# EAGLE design Debug Board (EAGLE 9.6.2)
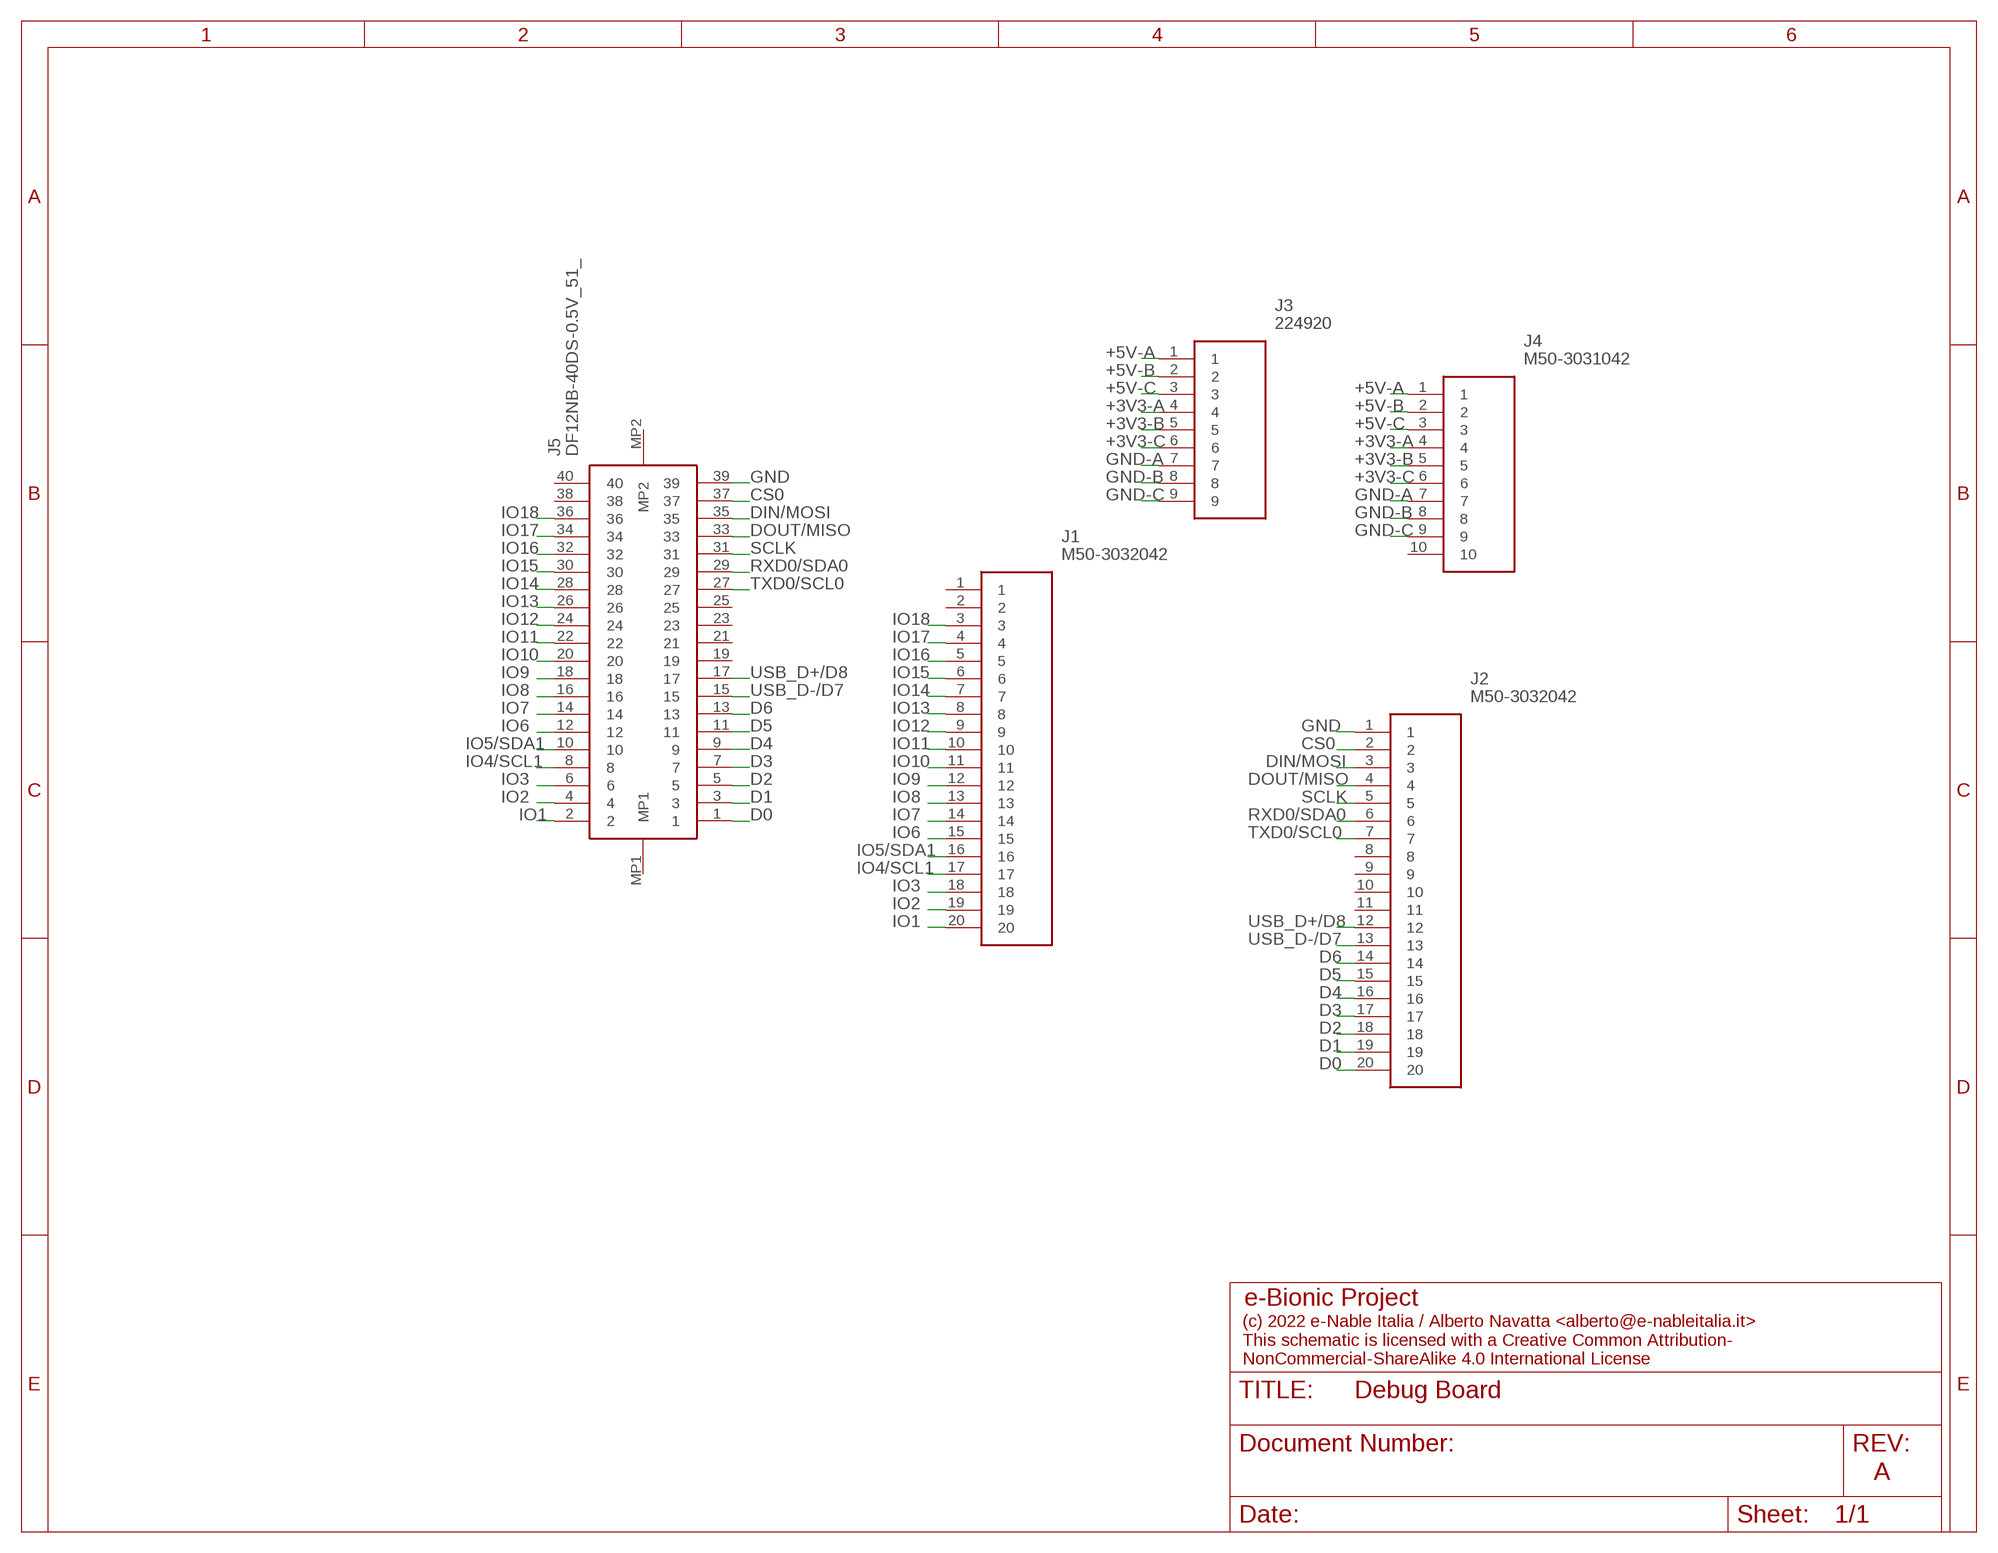
[diagram p0: schematic, sheet 1]

## Parts
J1  M50-3032042  [M503032042]
J2  M50-3032042  [M503032042]
J3  224920  [224920]
J4  M50-3031042  [M503031042]
J5  DF12NB-40DS-0.5V_51_  [DF12NB40DS05V51]

## Nets
+3V3-A [Power]: J3.4 J4.4
+3V3-B [Power]: J3.5 J4.5
+3V3-C [Power]: J3.6 J4.6
+5V-A [Power]: J3.1 J4.1
+5V-B [Power]: J3.2 J4.2
+5V-C [Power]: J3.3 J4.3
CS0: J2.2 J5.37
D0: J2.20 J5.1
D1: J2.19 J5.3
D2: J2.18 J5.5
D3: J2.17 J5.7
D4: J2.16 J5.9
D5: J2.15 J5.11
D6: J2.14 J5.13
DIN/MOSI: J2.3 J5.35
DOUT/MISO: J2.4 J5.33
GND [GND]: J2.1 J5.39
GND-A [GND]: J3.7 J4.7
GND-B [GND]: J3.8 J4.8
GND-C [GND]: J3.9 J4.9
IO1: J1.20 J5.2
IO2: J1.19 J5.4
IO3: J1.18 J5.6
IO4/SCL1: J1.17 J5.8
IO5/SDA1: J1.16 J5.10
IO6: J1.15 J5.12
IO7: J1.14 J5.14
IO8: J1.13 J5.16
IO9: J1.12 J5.18
IO10: J1.11 J5.20
IO11: J1.10 J5.22
IO12: J1.9 J5.24
IO13: J1.8 J5.26
IO14: J1.7 J5.28
IO15: J1.6 J5.30
IO16: J1.5 J5.32
IO17: J1.4 J5.34
IO18: J1.3 J5.36
RXD0/SDA0: J2.6 J5.29
SCLK: J2.5 J5.31
TXD0/SCL0: J2.7 J5.27
USB_D+/D8: J2.12 J5.17
USB_D-/D7: J2.13 J5.15
Unconnected: J1.1 J1.2 J2.8 J2.9 J2.10 J2.11 J4.10 J5.19 J5.21 J5.23 J5.25 J5.38 J5.40 J5.MP1 J5.MP2

## Notes on the sheet
- e-Bionic Project
- (c) 2022 e-Nable Italia / Alberto Navatta <alberto@e-nableitalia.it>
  This schematic is licensed with a Creative Common Attribution-
  NonCommercial-ShareAlike 4.0 International License
- A

## Library data of the parts
J1 J2 = SamacSys_Parts:M50-3032042: Headers & Wire Housings 20 WAY SIL VERT PC TAIL SKT Source: Datasheet <https://cdn.harwin.com/pdfs/M50-303.pdf>; DESCRIPTION: Headers & Wire Housings 20 WAY SIL VERT PC TAIL SKT; HEIGHT: 4.55mm; MANUFACTURER_NAME: Harwin; MANUFACTURER_PART_NUMBER: M50-3032042; MOUSER_PART_NUMBER: 855-M50-3032042; MOUSER_PRICE-STOCK: https://www.mouser.co.uk/ProductDetail/Harwin/M50-3032042?qs=%252BdQmOuGyFcG1Q4VMzC2p1Q%3D%3D
J3 = SamacSys_Parts:224920: Board to Board & Mezzanine Connectors 9P 0.8MM VERT FML CLASS 4 3MM SMT Source: Datasheet; DESCRIPTION: Board to Board & Mezzanine Connectors 9P 0.8MM VERT FML CLASS 4 3MM SMT; HEIGHT: 3.96mm; MANUFACTURER_NAME: ERNI; MANUFACTURER_PART_NUMBER: 224920; MOUSER_PART_NUMBER: 305-224920; MOUSER_PRICE-STOCK: https://www.mouser.co.uk/ProductDetail/ERNI/224920?qs=Kh9WxvXxjWmfiTh6L%2FvUxg%3D%3D
J4 = SamacSys_Parts:M50-3031042: Headers & Wire Housings 10 WAY SIL VERT PC TAIL SKT Source: Datasheet <https://cdn.harwin.com/pdfs/M50-303.pdf>; DESCRIPTION: Headers & Wire Housings 10 WAY SIL VERT PC TAIL SKT; HEIGHT: 4.55mm; MANUFACTURER_NAME: Harwin; MANUFACTURER_PART_NUMBER: M50-3031042; MOUSER_PART_NUMBER: 855-M50-3031042; MOUSER_PRICE-STOCK: https://www.mouser.co.uk/ProductDetail/Harwin/M50-3031042?qs=%252BdQmOuGyFcGr7bDrWORUuA%3D%3D
J5 = SamacSys_Parts:DF12NB-40DS-0.5V_51_: Board to Board & Mezzanine Connectors CONN RCPT 36POS SMD Source: Datasheet <https://www.hirose.com/en/product/document?clcode=CL0537-0290-0-51&productname=DF12NB-40DS-0.5V(51)&series=DF12N&documenttype=2DDrawing&lang=en&documentid=0001367362>; DESCRIPTION: Board to Board & Mezzanine Connectors CONN RCPT 36POS SMD; HEIGHT: 2.9mm; MANUFACTURER_NAME: Hirose; MANUFACTURER_PART_NUMBER: DF12NB-40DS-0.5V(51); MOUSER_PART_NUMBER: 798-DF12NB40DS0551; MOUSER_PRICE-STOCK: https://www.mouser.co.uk/ProductDetail/Hirose-Connector/DF12NB-40DS-0.5V51?qs=DPoM0jnrROV9WbEBnogTmg%3D%3D

## Net classes
2 Power: width 0.203 mm

## Board
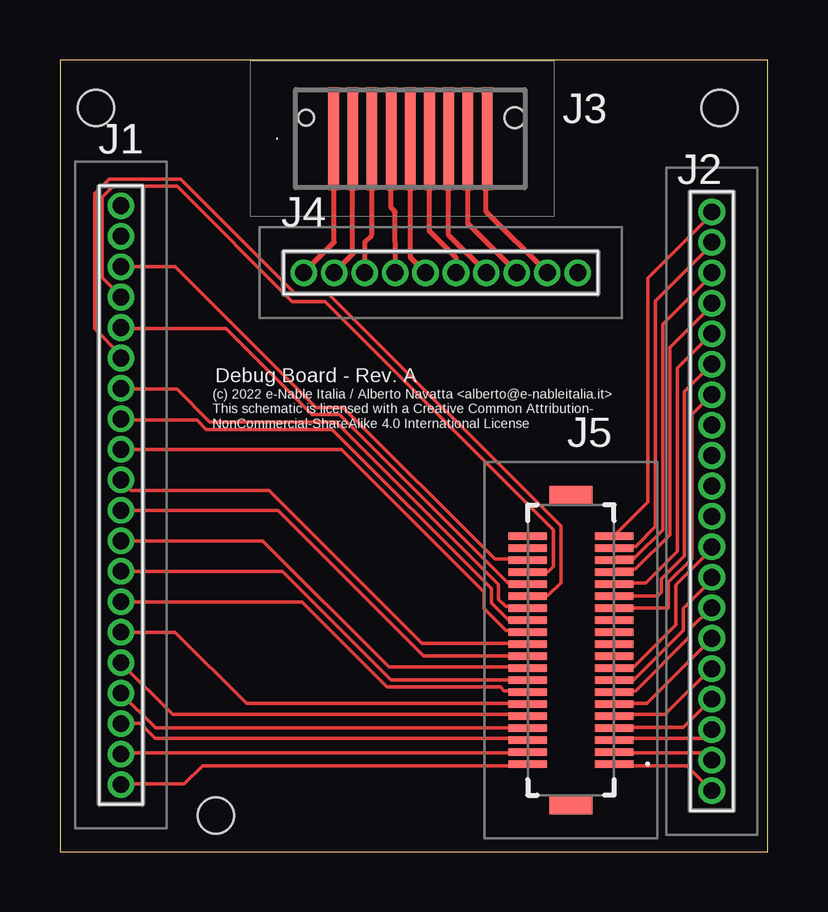
[diagram p1: board, top side]

Size 29.5 x 33 mm. Coordinates in mm from the lower left corner, seen from the top.
Outline: 0,0 29.5,0 29.5,33 0,33 0,0
Copper layers (1*16): Top 0.035mm / dielectric 1.5mm / Bottom 0.035mm
Design rules "default *": minimum track width 6mil, minimum drill 0.35mm, track to track 6mil, track to pad 6mil, pad to pad 6mil, via to via 6mil, smd to smd 6mil, copper to edge 18mil, drill to drill 6mil, minimum pad ring 8mil, minimum via ring 8mil, stop-mask expansion 4mil, vias tented up to drill 0mil, thermal gap 10mil
Holes 1.5 mm at 1.5,31 27.5,31 6.5,1.5

### Footprints (pad centres in the part's own frame; a part is rotated, then mirrored left to right if it is on the bottom)
M503032042 = drill 0.7 pad 1.1: 1 0,0; 2 1.27,0; 3 2.54,0; 4 3.81,0; 5 5.08,0; 6 6.35,0; 7 7.62,0; 8 8.89,0; 9 10.16,0; 10 11.43,0; 11 12.7,0; 12 13.97,0; 13 15.24,0; 14 16.51,0; 15 17.78,0; 16 19.05,0; 17 20.32,0; 18 21.59,0; 19 22.86,0; 20 24.13,0
224920 = smd 0.44 x 4.3: 1 -3.2,0; 2 -2.4,0; 3 -1.6,0; 4 -0.8,0; 5 0,0; 6 0.8,0; 7 1.6,0; 8 2.4,0; 9 3.2,0 | hole 0.65: -4.35,0.88 | hole 0.85: 4.35,0.88
M503031042 = drill 0.7 pad 1.1: 1 0,0; 2 1.27,0; 3 2.54,0; 4 3.81,0; 5 5.08,0; 6 6.35,0; 7 7.62,0; 8 8.89,0; 9 10.16,0; 10 11.43,0
DF12NB40DS05V51 = smd 0.3 x 1.6: 1 -4.75,-1.8; 2 -4.75,1.8; 3 -4.25,-1.8; 4 -4.25,1.8; 5 -3.75,-1.8; 6 -3.75,1.8; 7 -3.25,-1.8; 8 -3.25,1.8; 9 -2.75,-1.8; 10 -2.75,1.8; 11 -2.25,-1.8; 12 -2.25,1.8; 13 -1.75,-1.8; 14 -1.75,1.8; 15 -1.25,-1.8; 16 -1.25,1.8; 17 -0.75,-1.8; 18 -0.75,1.8; 19 -0.25,-1.8; 20 -0.25,1.8; 21 0.25,-1.8; 22 0.25,1.8; 23 0.75,-1.8; 24 0.75,1.8; 25 1.25,-1.8; 26 1.25,1.8; 27 1.75,-1.8; 28 1.75,1.8; 29 2.25,-1.8; 30 2.25,1.8; 31 2.75,-1.8; 32 2.75,1.8; 33 3.25,-1.8; 34 3.25,1.8; 35 3.75,-1.8; 36 3.75,1.8; 37 4.25,-1.8; 38 4.25,1.8; 39 4.75,-1.8; 40 4.75,1.8 | smd 0.8 x 1.8: MP1 -6.45,0; MP2 6.45,0

### Placement (x,y rotation side)
J1  2.54,26.92 270 top
J2  27.18,26.67 270 top
J3  14.61,29.72 0 top
J4  10.16,24.13 0 top
J5  21.3,8.4 90 top

### Tracks (layer width: path | path; a pad name or v marks a point on that pad's centre or on a via)
+3V3-A
  Top 0.203: J4.4 13.97,25.4 13.97,26.67 13.8,26.84 J3.4
+3V3-B
  Top 0.203: J4.5 14.61,24.77 J3.5
+3V3-C
  Top 0.203: J4.6 16.51,24.77 15.56,25.72 15.4,25.87 J3.6
+5V-A
  Top 0.203: J3.1 11.43,29.69 11.43,25.4 J4.1
+5V-B
  Top 0.203: J4.2 12.21,24.91 J3.2
+5V-C
  Top 0.203: J4.3 12.7,25.4 13.01,25.7 J3.3
CS0
  Top 0.152: J5.37 23.16,12.72 24,12.72 24.82,13.54 24.82,22.95 27.13,25.26 27.13,25.38 J2.2
D0
  Top 0.152: J2.20 26.14,3.58 23.16,3.58 J5.1
D1
  Top 0.152: J5.3 23.16,4.12 26.82,4.12 27.13,3.81 J2.19
D2
  Top 0.152: J2.18 26.82,4.72 23.16,4.72 J5.5
D3
  Top 0.152: J5.7 23.16,5.18 25.98,5.18 27.13,6.33 J2.17
D4
  Top 0.152: J5.9 23.16,5.71 25.22,5.71 27.13,7.62 J2.16
D5
  Top 0.152: J2.15 24.46,6.17 23.16,6.17 J5.11
D6
  Top 0.152: J5.13 23.16,6.71 24,6.71 26.29,8.99 26.29,9.3 27.13,10.13 J2.14
DIN/MOSI
  Top 0.152: 23.93,12.19 23.16,12.19 J5.35 23.22,12.27 24,12.27 25.13,13.4 25.13,21.99 27.18,24.04 J2.3
DOUT/MISO
  Top 0.152: J5.33 23.22,11.77 24,11.77 25.43,13.21 25.43,21.02 27.18,22.77 J2.4
GND
  Top 0.152: 23.09,13.18 J5.39 24.52,14.57 24.52,20.32 24.52,23.92 27.18,26.58 J2.1 27.13,26.67
GND-A
  Top 0.203: J4.7 16.2,25.7 J3.7
GND-B
  Top 0.152: 17.14,27.96 17.04,29.25 J3.8
  Top 0.203: J4.8 17,26.18 17,29.21 17.04,29.25
GND-C
  Top 0.152: 17.68,27.96 17.77,29.21 J3.9 | 20.34,24.08 J4.9 20.41,24.13
  Top 0.203: 17.77,29.21 17.77,26.68 J4.9
IO1
  Top 0.152: J5.2 19.43,3.58 5.94,3.58 5.18,2.82 2.59,2.82 J1.20
IO2
  Top 0.152: J5.4 19.43,4.12 2.59,4.12 J1.19
IO3
  Top 0.152: J5.6 19.43,4.72 3.96,4.72 3.35,5.33 J1.18
IO4/SCL1
  Top 0.152: 19.43,5.18 J5.8 3.99,5.15 J1.17
IO5/SDA1
  Top 0.152: J5.10 19.43,5.71 4.7,5.71 J1.16
IO6
  Top 0.152: J5.12 19.43,6.17 7.77,6.17 4.8,9.14 J1.15
IO7
  Top 0.152: J5.14 19.43,6.71 18.52,6.71 18.36,6.86 13.64,6.86 10.08,10.41 J1.14
IO8
  Top 0.152: J5.16 19.43,7.16 13.79,7.16 9.27,11.68 J1.13
IO9
  Top 0.152: J5.18 19.43,7.7 13.72,7.7 8.46,12.95 J1.12
IO10
  Top 0.152: J5.20 19.43,8.15 15.16,8.15 9.09,14.22 J1.11
IO11
  Top 0.152: J5.22 19.43,8.69 15.09,8.69 8.71,15.06 2.97,15.06 J1.10
IO12
  Top 0.152: J5.24 19.43,9.22 18.59,9.22 17.68,10.13 17.68,10.82 11.73,16.76 J1.9
IO13
  Top 0.152: J5.26 19.43,9.68 18.67,9.68 17.98,10.36 17.98,10.97 11.35,17.6 6.1,17.6 5.71,17.98 2.59,17.98 J1.8
IO14
  Top 0.152: J5.28 19.43,10.21 18.59,10.21 18.29,10.52 18.29,11.12 11.51,17.91 6.25,17.91 4.88,19.28 2.59,19.28 J1.7
IO15
  Top 0.152: J5.30 19.51,10.67 20.34,10.67 20.88,11.2 20.88,13.56 11.2,23.24 9.83,23.24 5.03,28.04 2.06,28.04 1.45,27.43 1.45,21.79 2.52,20.73 2.52,20.57 J1.6
IO16
  Top 0.152: J5.32 19.43,11.2 18.67,11.2 11.66,18.21 10.52,18.21 6.93,21.79 2.59,21.79 J1.5
IO17
  Top 0.152: J5.34 20.34,11.66 20.57,11.89 20.57,13.41 11.05,22.94 9.68,22.94 4.88,27.74 2.21,27.74 1.75,27.28 1.75,23.93 2.52,23.16 J1.4
IO18
  Top 0.152: J5.36 19.43,12.19 18.14,12.19 11.81,18.52 10.67,18.52 4.8,24.38 J1.3
RXD0/SDA0
  Top 0.152: J5.29 24.93,10.65 25.07,10.79 25.07,11.36 26.04,12.33 26.04,19.18 J2.6
SCLK
  Top 0.152: J5.31 23.16,11.2 24.43,11.2 25.74,12.5 25.74,20.15 J2.5
TXD0/SCL0
  Top 0.152: 23.16,10.21 J5.27 25.38,10.16 25.38,11.23 26.34,12.21 26.34,18.22 J2.7
USB_D+/D8
  Top 0.152: J5.17 23.16,7.7 23.93,7.7 25.68,9.45 25.68,11.11 27.18,12.61 J2.12
USB_D-/D7
  Top 0.152: J5.15 23.16,7.16 23.93,7.16 25.98,9.22 25.98,10.14 27.13,11.29 27.13,11.43 J2.13

### Text on the board
tNames: Debug Board - Rev. A | (c) 2022 e-Nable Italia / Alberto Navatta <alberto@e-nableitalia.it> / This schematic is licensed with a Creative Common Attribution- / NonCommercial-ShareAlike 4.0 International License